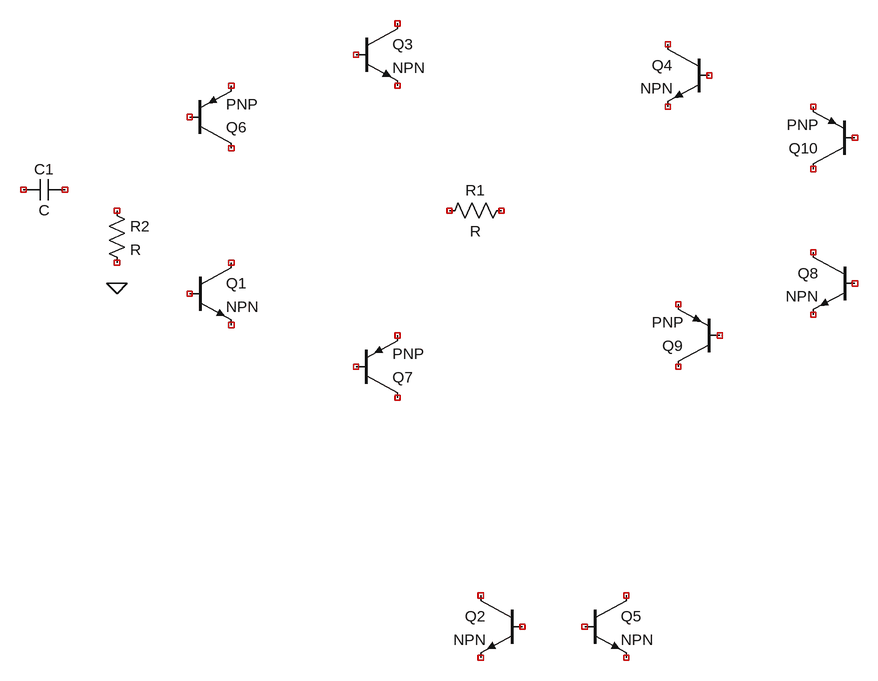
[diagram p0: schematic Breitband_Leistung.asc]
Breitband_Leistung.asc, the LTspice schematic file:
Version 4
SHEET 1 1556 1048
FLAG 160 464 0
SYMBOL npn 272 432 R0
SYMATTR InstName Q1
SYMBOL npn 784 944 M0
SYMATTR InstName Q2
SYMBOL npn 528 64 R0
SYMATTR InstName Q3
SYMBOL npn 1072 96 M0
SYMATTR InstName Q4
SYMBOL npn 880 944 R0
SYMATTR InstName Q5
SYMBOL pnp 272 256 M180
SYMATTR InstName Q6
SYMBOL pnp 528 640 M180
SYMATTR InstName Q7
SYMBOL res 768 336 R90
WINDOW 0 0 56 VBottom 2
WINDOW 3 32 56 VTop 2
SYMATTR InstName R1
SYMBOL npn 1296 416 M0
SYMATTR InstName Q8
SYMBOL pnp 1088 592 R180
SYMATTR InstName Q9
SYMBOL pnp 1296 288 R180
SYMATTR InstName Q10
SYMBOL res 144 336 R0
SYMATTR InstName R2
SYMBOL cap 80 304 R90
WINDOW 0 0 32 VBottom 2
WINDOW 3 32 32 VTop 2
SYMATTR InstName C1

The netlist it stands for:
* Breitband_Leistung.asc
Q1 NC_01 NC_02 NC_03 0 NPN
Q2 NC_04 NC_05 NC_06 0 NPN
Q3 NC_07 NC_08 NC_09 0 NPN
Q4 NC_10 NC_11 NC_12 0 NPN
Q5 NC_13 NC_14 NC_15 0 NPN
Q6 NC_16 NC_17 NC_18 0 PNP
Q7 NC_19 NC_20 NC_21 0 PNP
R1 NC_22 NC_23 R
Q8 NC_24 NC_25 NC_26 0 NPN
Q9 NC_27 NC_28 NC_29 0 PNP
Q10 NC_30 NC_31 NC_32 0 PNP
R2 NC_33 NC_34 R
C1 NC_35 NC_36 C
.model NPN NPN
.model PNP PNP
.lib standard.bjt
.backanno
.end